# EAGLE design FED3_v6.3 (EAGLE 9.5.1)
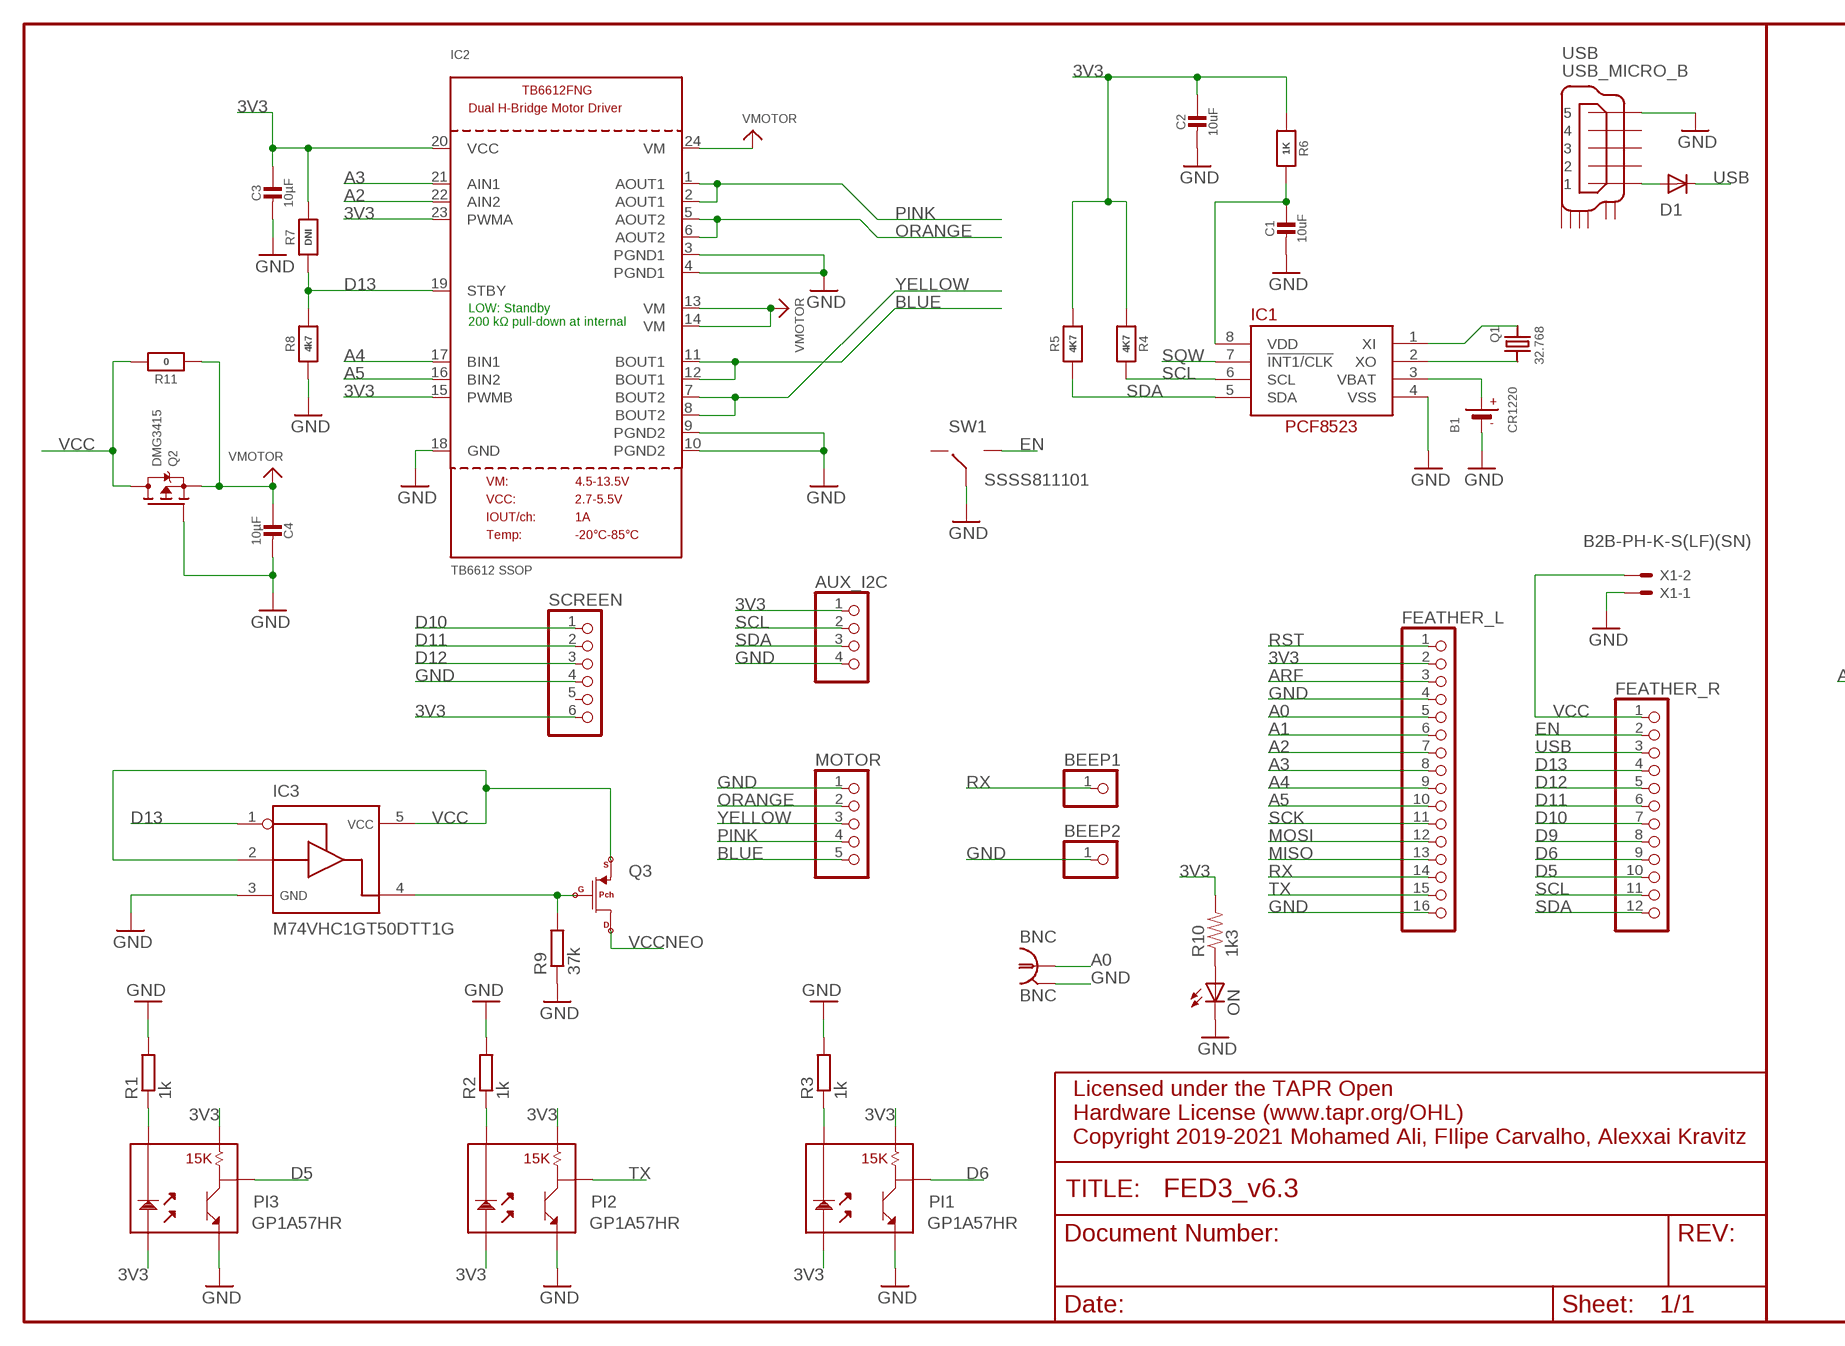
[diagram p0: schematic, sheet 1, part 1 of 2]
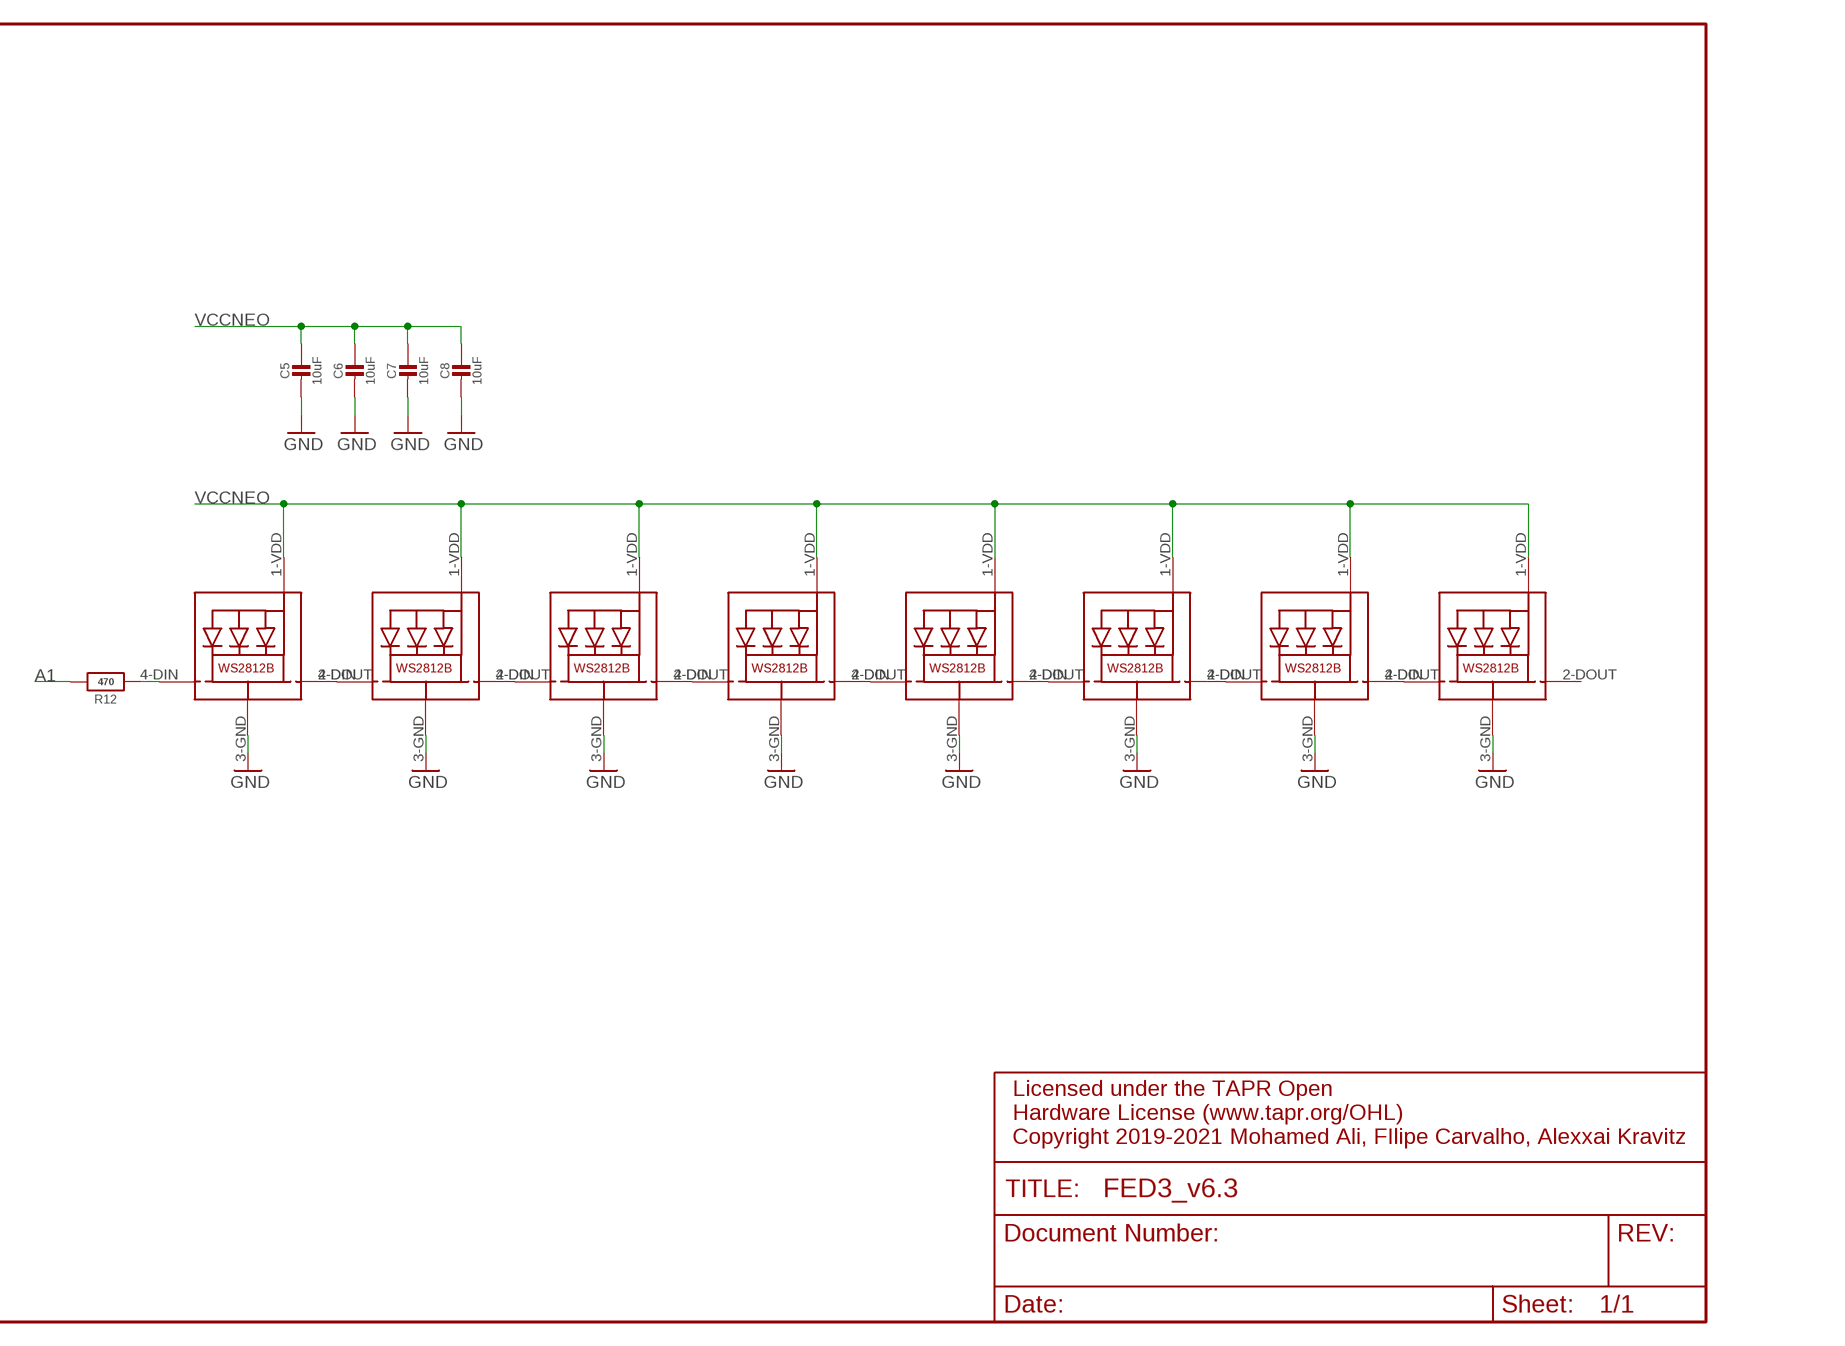
[diagram p1: schematic, sheet 1, part 2 of 2]

## Parts
AUX_I2C  PINHD-1X4  [1X04]
B1  CR1220  BATTERYCR1220_SMT  [CR1220]
BEEP1  PINHD-1X1  [1X01]
BEEP2  PINHD-1X1  [1X01]
BNC  BNC  [BNC_RA]
C1  10uF  CAP_CERAMIC0805-NOOUTLINE  [0805-NO]
C2  10uF  CAP_CERAMIC0805-NOOUTLINE  [0805-NO]
C3  10µF  CAP_CERAMIC0805-NOOUTLINE  [0805-NO]
C4  10µF  CAP_CERAMIC0805-NOOUTLINE  [0805-NO]
C5  10uF  CAP_CERAMIC0805-NOOUTLINE  [0805-NO]
C6  10uF  CAP_CERAMIC0805-NOOUTLINE  [0805-NO]
C7  10uF  CAP_CERAMIC0805-NOOUTLINE  [0805-NO]
C8  10uF  CAP_CERAMIC0805-NOOUTLINE  [0805-NO]
D1  DIODE-DO-214AC  [DO-214AC]
FEATHER_L  PINHD-1X16  [1X16]
FEATHER_R  PINHD-1X12  [1X12]
IC1  RTC_PCF8523T  [SOIC8_150MIL]
IC2  TB6612 SSOP  TB6612FNGSSOP  [SSOP24]
IC3  M74VHC1GT50DTT1G  SN74LVC1G125  [SOT23-5]
LED1  WS2812B5050  [WS2812B]
LED2  WS2812B5050  [WS2812B]
LED3  WS2812B5050  [WS2812B]
LED4  WS2812B5050  [WS2812B]
LED5  WS2812B5050  [WS2812B]
LED6  WS2812B5050  [WS2812B]
LED7  WS2812B5050  [WS2812B]
LED8  WS2812B5050  [WS2812B]
MOTOR  PINHD-1X5  [1X05]
ON  LEDCHIPLED_0603  [CHIPLED_0603]
PI1  GP1A57HR  [GP1A57HR]
PI2  GP1A57HR  [GP1A57HR]
PI3  GP1A57HR  [GP1A57HR]
Q1  32.768  CRYSTAL8.0X3.8  [CRYSTAL_8X3.8]
Q2  DMG3415  MOSFET-PWIDE  [SOT23-WIDE]
Q3  MOSFET_P-CH  [TSMT3]
R1  1k  R-EU_R0805  [R0805]
R2  1k  R-EU_R0805  [R0805]
R3  1k  R-EU_R0805  [R0805]
R4  4K7  RESISTOR0805_NOOUTLINE  [0805-NO]
R5  4K7  RESISTOR0805_NOOUTLINE  [0805-NO]
R6  1K  RESISTOR0805_NOOUTLINE  [0805-NO]
R7  DNI  RESISTOR0805_NOOUTLINE  [0805-NO]
R8  4k7  RESISTOR0805_NOOUTLINE  [0805-NO]
R9  37k  R-EU_R0805  [R0805]
R10  1k3  RESISTOR  [0805]
R11  0  RESISTOR0805_NOOUTLINE  [0805-NO]
R12  470  RESISTOR0805_NOOUTLINE  [0805-NO]
SCREEN  PINHD-1X6  [1X06]
SW1  SSSS811101  [SSSS811101]
USB  USB_MICRO_B  [ZX62D-B-5P8]
X1  B2B-PH-K-S(LF)(SN)  JST-XH-02-PIN-ROUND-PAD  [JST-XH-02-PACKAGE-ROUND-PAD]

## Nets
3V3: AUX_I2C.1 C2.1 C3.1 FEATHER_L.2 IC2.15(PWMB) IC2.20(VCC) IC2.23(PWMA) PI1.1 PI1.3 PI2.1 PI2.3 PI3.1 PI3.3 R4.1 R5.2 R6.1 R7.2 R10.2 SCREEN.6
A0: BNC.1 FEATHER_L.5
A1: FEATHER_L.6 R12.2
A2: FEATHER_L.7 IC2.22(AIN2)
A3: FEATHER_L.8 IC2.21(AIN1)
A4: FEATHER_L.9 IC2.17(BIN1)
A5: FEATHER_L.10 IC2.16(BIN2)
ARF: FEATHER_L.3
BLUE: IC2.11(BOUT1) IC2.12(BOUT1) MOTOR.5
D5: FEATHER_R.10 PI3.4
D6: FEATHER_R.9 PI1.4
D9: FEATHER_R.8
D10: FEATHER_R.7 SCREEN.1
D11: FEATHER_R.6 SCREEN.2
D12: FEATHER_R.5 SCREEN.3
D13: FEATHER_R.4 IC2.19(STBY) IC3.1 R7.1 R8.2
EN: FEATHER_R.2 SW1.3
GND: AUX_I2C.4 B1.- BEEP2.1 BNC.2 C1.2 C2.2 C3.2 C4.2 C5.2 C6.2 C7.2 C8.2 FEATHER_L.4 FEATHER_L.16 IC1.4(VSS) IC2.3(PGND1) IC2.4(PGND1) IC2.9(PGND2) IC2.10(PGND2) IC2.18(GND) IC3.3 LED1.3-GND(GND) LED2.3-GND(GND) LED3.3-GND(GND) LED4.3-GND(GND) LED5.3-GND(GND) LED6.3-GND(GND) LED7.3-GND(GND) LED8.3-GND(GND) MOTOR.1 ON.C PI1.5 PI2.5 PI3.5 Q2.1(G) R1.2 R2.2 R3.2 R8.1 R9.1 SCREEN.4 SW1.2 USB.P$5 X1.1
MISO: FEATHER_L.13
MOSI: FEATHER_L.12
N$1: PI2.2 R2.1
N$2: PI3.2 R1.1
N$3: PI1.2 R3.1
N$4: D1.A USB.P$1
N$5: LED1.2-DOUT(DO) LED2.4-DIN(DI)
N$6: C1.1 IC1.8(VDD) R6.2
N$7: LED2.2-DOUT(DO) LED3.4-DIN(DI)
N$8: ON.A R10.1
N$9: LED3.2-DOUT(DO) LED4.4-DIN(DI)
N$10: LED4.2-DOUT(DO) LED5.4-DIN(DI)
N$11: LED5.2-DOUT(DO) LED6.4-DIN(DI)
N$12: LED6.2-DOUT(DO) LED7.4-DIN(DI)
N$13: LED7.2-DOUT(DO) LED8.4-DIN(DI)
N$14: IC1.1(XI) Q1.P$1
N$15: IC1.2(XO) Q1.P$4
N$16: LED1.4-DIN(DI) R12.1
ORANGE: IC2.5(AOUT2) IC2.6(AOUT2) MOTOR.2
OUT3: IC3.4 Q3.P$1(G) R9.2
PINK: IC2.1(AOUT1) IC2.2(AOUT1) MOTOR.4
RST: FEATHER_L.1
RX: BEEP1.1 FEATHER_L.14
SCK: FEATHER_L.11
SCL: AUX_I2C.2 FEATHER_R.11 IC1.6(SCL) R4.2
SDA: AUX_I2C.3 FEATHER_R.12 IC1.5(SDA) R5.1
SQW: IC1.7(!INT1/CLK)
TX: FEATHER_L.15 PI2.4
USB: D1.C FEATHER_R.3
VBAT1: B1.+$1(+) IC1.3(VBAT)
VCC: FEATHER_R.1 IC3.2 IC3.5 Q2.3(D) Q3.P$2(S) R11.2 X1.2
VCCNEO: C5.1 C6.1 C7.1 C8.1 LED1.1-VDD(VDD) LED2.1-VDD(VDD) LED3.1-VDD(VDD) LED4.1-VDD(VDD) LED5.1-VDD(VDD) LED6.1-VDD(VDD) LED7.1-VDD(VDD) LED8.1-VDD(VDD) Q3.P$3(D)
VMOTOR: C4.1 IC2.13(VM) IC2.14(VM) IC2.24(VM) Q2.2(S) R11.1
YELLOW: IC2.7(BOUT2) IC2.8(BOUT2) MOTOR.3
Unconnected: LED8.2-DOUT(DO) SCREEN.5 SW1.1 USB.P$2 USB.P$3 USB.P$4 USB.P$6 USB.P$7 USB.SHIELD_1 USB.SHIELD_2 USB.SHIELD_3 USB.SHIELD_4

## Notes on the sheet
- LOW: Standby
  200 kΩ pull-down at internal
- Licensed under the TAPR Open
  Hardware License (www.tapr.org/OHL)
  Copyright 2019-2021 Mohamed Ali, FIlipe Carvalho, Alexxai Kravitz
- Licensed under the TAPR Open
  Hardware License (www.tapr.org/OHL)
  Copyright 2019-2021 Mohamed Ali, FIlipe Carvalho, Alexxai Kravitz

## Library data of the parts
AUX_I2C = pinhead:PINHD-1X4: PIN HEADER
B1 = microbuilder:BATTERY: CR1220 SMT - Digikey: 3001K-ND CD2032 BAT-HLD-001 - Digikey: BAT-HLD-001-ND
BEEP1 BEEP2 = pinhead:PINHD-1X1: PIN HEADER
BNC = CNP-connectors:BNC
C1-C8 = microbuilder:CAP_CERAMIC: Ceramic Capacitors For new designs, use the packages preceded by an '_' character since they are more reliable: The following footprints should be used on most boards: _0402 - Standard footprint for regular board layouts _0603 - Standard footprint for regular board layouts _0805 - Standard footprint for regular board layouts _1206 - Standard footprint for regular board layouts For extremely tight-pitch boards where space is at a premium, the following 'micro-pitch' footprints can be used (smaller pads, no silkscreen outline, etc.): _0402MP - Micro-pitch footprint for very dense/compact boards _0603MP - Micro-pitch footprint for very dense/compact boards _0805MP - Micro-pitch footprint for very dense/compact boards _1206MP - Micro-pitch footprint for very dense/compact boards
D1 = diode:DIODE-: DIODE
FEATHER_L = pinhead:PINHD-1X16: PIN HEADER
FEATHER_R = pinhead:PINHD-1X12: PIN HEADER
IC1 = microbuilder:RTC_PCF8523
IC2 = microbuilder:TB6612FNG: TB6612FNG Dual H-Bridge Motor Driver
IC3 = My_library 0v2:SN74LVC1G125
LED1-LED8 = microbuilder:WS2812B5050
MOTOR = pinhead:PINHD-1X5: PIN HEADER
ON = led:LED: LED OSRAM: - CHIPLED LG R971, LG N971, LY N971, LG Q971, LY Q971, LO R971, LY R971 LH N974, LH R974 LS Q976, LO Q976, LY Q976 LO Q996 - Hyper CHIPLED LW Q18S LB Q993, LB Q99A, LB R99A - SideLED LS A670, LO A670, LY A670, LG A670, LP A670 LB A673, LV A673, LT A673, LW A673 LH A674 LY A675 LS A676, LA A676, LO A676, LY A676, LW A676 LS A679, LY A679, LG A679 - Hyper Micro SIDELED® LS Y876, LA Y876, LO Y876, LY Y876 LT Y87S - SmartLED LW L88C, LW L88S LB L89C, LB L89S, LG L890 LS L89K, LO L89K, LY L89K LS L896, LA L896, LO L896, LY L896 - TOPLED LS T670, LO T670, LY T670, LG T670, LP T670 LSG T670, LSP T670, LSY T670, LOP T670, LYG T670 LG T671, LOG T671, LSG T671 LB T673, LV T673, LT T673, LW T673 LH T674 LS T676, LA T676, LO T676, LY T676, LB T676, LH T676, LSB T676, LW T676 LB T67C, LV T67C, LT T67C, LS T67K, LO T67K, LY T67K, LW E67C LS E67B, LA E67B, LO E67B, LY E67B, LB E67C, LV E67C, LT E67C LW T67C LS T679, LY T679, LG T679 LS T770, LO T770, LY T770, LG T770, LP T770 LB T773, LV T773, LT T773, LW T773 LH T774 LS E675, LA E675, LY E675, LS T675 LS T776, LA T776, LO T776, LY T776, LB T776 LHGB T686 LT T68C, LB T68C - Hyper Mini TOPLED® LB M676 - Mini TOPLED Santana® LG M470 LS M47K, LO M47K, LY M47K Source: http://www.osram.convergy.de LUXEON: - LUMILED® LXK2-PW12-R00, LXK2-PW12-S00, LXK2-PW14-U00, LXK2-PW14-V00 LXK2-PM12-R00, LXK2-PM12-S00, LXK2-PM14-U00 LXK2-PE12-Q00, LXK2-PE12-R00, LXK2-PE12-S00, LXK2-PE14-T00, LXK2-PE14-U00 LXK2-PB12-K00, LXK2-PB12-L00, LXK2-PB12-M00, LXK2-PB14-N00, LXK2-PB14-P00, LXK2-PB14-Q00 LXK2-PR12-L00, LXK2-PR12-M00, LXK2-PR14-Q00, LXK2-PR14-R00 LXK2-PD12-Q00, LXK2-PD12-R00, LXK2-PD12-S00 LXK2-PH12-R00, LXK2-PH12-S00 LXK2-PL12-P00, LXK2-PL12-Q00, LXK2-PL12-R00 Source: www.luxeon.com KINGBRIGHT: KA-3528ASYC Source: www.kingbright.com
PI1-PI3 = SparkFun:GP1A57HR
Q1 = microbuilder:CRYSTAL: Crystals HC49UP - Surface Mount Crystal 4.0MHz 18pF +/-30ppm Surface Mount Crystal [Digikey: 535-9857-1-ND] 12.0 MHz Surface Mount Crystal [Digikey: 535-9869-6-ND] 25.0 MHz Surface Mount Crystal [Digikey: 535-9078-1-ND] 2.5 x 2.0mm - MEMs SMT Crystal 16.0 MHz 10pF 20ppm 2.5 x 2.0mm Crystal [Digikey -40-85°C: 535-10923-1-ND] 3.2 x 2.5mm - MEMs SMT Crystal 12.0 MHz 8pF 15ppm 3.2 x 2.5mm Crystal [Digikey: -10-70°C: 644-1047-1-ND -40-125°C: 644-1128-1-ND] 40~85°C cheaper: 644-1173-6-ND 16.0 MHz 8pF 15ppm 3.2 x 2.5mm Crystal [Digikey: -10-70°C: 644-1049-1-ND -40-125°C: 644-1129-2-ND]-40~85°C cheaper: 644-1175-6-ND 16.0 MHz 10pF 10ppm 3.2 x 2.5mm Crystal [Digikey: 644-1100-1-ND] 27.12 MHz 18pF 30ppm 3.2 x 2.5mm Crystal [Digikey: 887-1424-1-ND] 27.12MHz 10pF 10ppm 3.2 x 2.5mm Crystal [Digikey: 887-1329-1-ND] 4.9 x 1.8mm - MEMs SMT Crystal 32.768 KHz 12.5pF 20ppm 4.9 x 1.8mm Crystal [Digikey: SE2415CT-ND] 8.0 x 3.8mm - Surface Mount Crystal 32.768kHz 12.5pF 20ppm -40°C-85°C [Digikey: 535-9166-2-ND] Cylinder 32.768KHz Cylinder Crystal (2x6mm body) [Ex. Digikey: 300-8341-2-ND]
Q2 = microbuilder:MOSFET-P: P-Channel Mosfet LEGEND VDS: Voltage Drain-Source ID: Drain Current RDS(ON): Drain-Source On-State Resistance VGS(TH): Gate-Source Threshold Voltage CISS: Drain-Source Input Capacitance SOT-23 Name VDS ID RDS(ON) VGS(TH) CISS Order Number IRLML5103 30V 760mA 600 mOhm -- 75pF @ 25V Digikey: IRLML5103PBFCT-ND IRLML6401 12V 4.3A 50 mOhm 950mV @ 250µA 830pF @ 10V Digikey: IRLML6401PBFTR-ND NTR0202PL 20V 400mA 800 mOhm 2.3V @ 250uA 70pF @ 5V Digikey: NTR0202PLT1GOSTR-ND NTR4101PT1G 20V 1.8A 85 mOhm 1.2V @ 250uA 675pF @ 10V Digikey: NTR4101PT1GOSCT-ND DMP2004K 20V 600mA 900 mOhm 1V @ 250uA 175pF @ 16V Digikey: DMP2004KDICT-ND PMV65XP 20V 3.9A 76 mOhm 950mV @ 1mA 725pF @ 20V Digikey: 568-2358-2-ND TO-252 Name VDS ID RDS(ON) VGS(TH) CISS Order Number AOD417 30V 25A 34 mOhm 3V @ 250µA 920pF @ 15V Digikey: 785-1106-2-ND
Q3 = CNP-miscellaneous:MOSFET_P-CH
R1-R3 R9 = rcl:R-EU_: RESISTOR, European symbol
R4-R8 R11 R12 = microbuilder:RESISTOR: Resistors For new designs, use the packages preceded by an '_' character since they are more reliable: The following footprints should be used on most boards: _0402 - Standard footprint for regular board layouts _0603 - Standard footprint for regular board layouts _0805 - Standard footprint for regular board layouts _1206 - Standard footprint for regular board layouts For extremely tight-pitch boards where space is at a premium, the following 'micro-pitch' footprints can be used (smaller pads, no silkscreen outline, etc.): _0402MP - Micro-pitch footprint for very dense/compact boards _0603MP - Micro-pitch footprint for very dense/compact boards _0805MP - Micro-pitch footprint for very dense/compact boards _1206MP - Micro-pitch footprint for very dense/compact boards
R10 = SparkFun:RESISTOR: Resistor Basic schematic elements and footprints for 0603, 1206, and PTH 1/10th watt (small) resistors.
SCREEN = pinhead:PINHD-1X6: PIN HEADER
SW1 = SSSS811101:SSSS811101
USB = CNP-connectors:USB_MICRO_B
X1 = Rembrandt Electronics - JST XH Connectors v1-0:JST-XH-02-PIN: JST XH Connector 2 Pin Wire to board connector. Pitch: 2,54 mm, (0.100") Number of pins: 2 Created by Rembrandt Electronics www.rembrandtelectronics.com

## Board
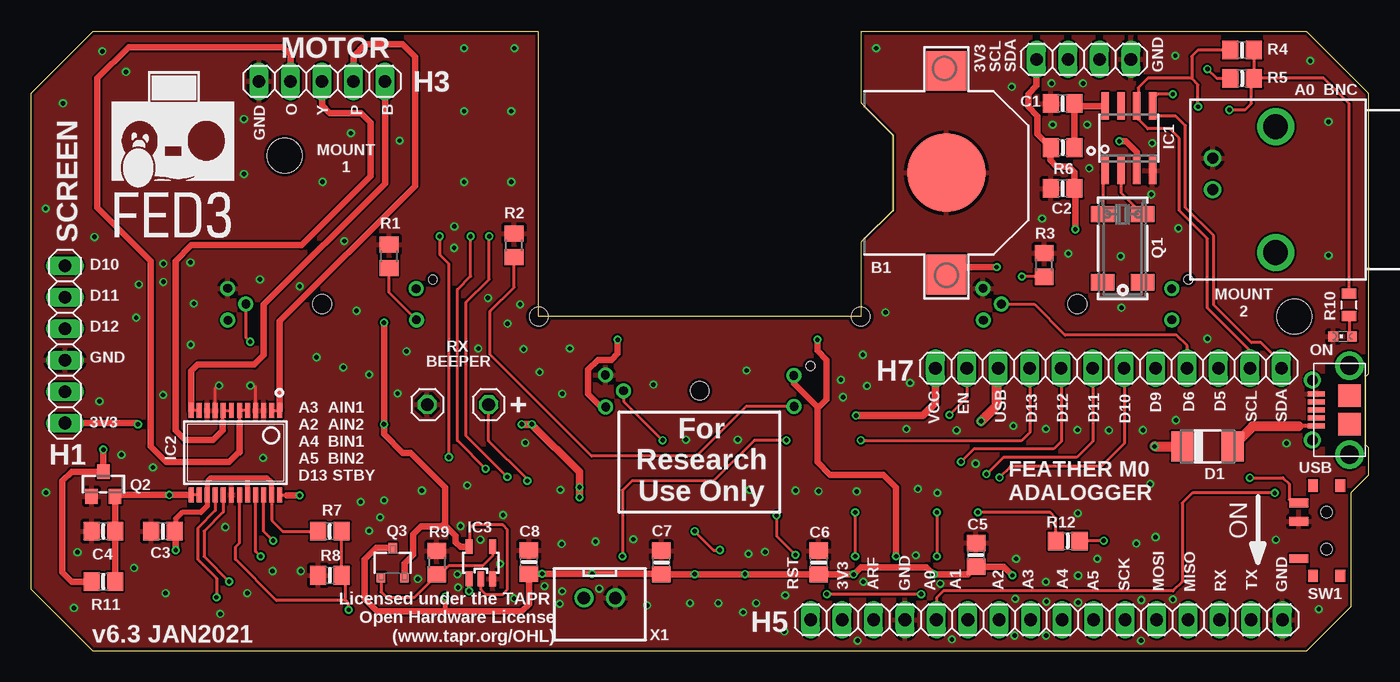
[diagram p2: board, top side]
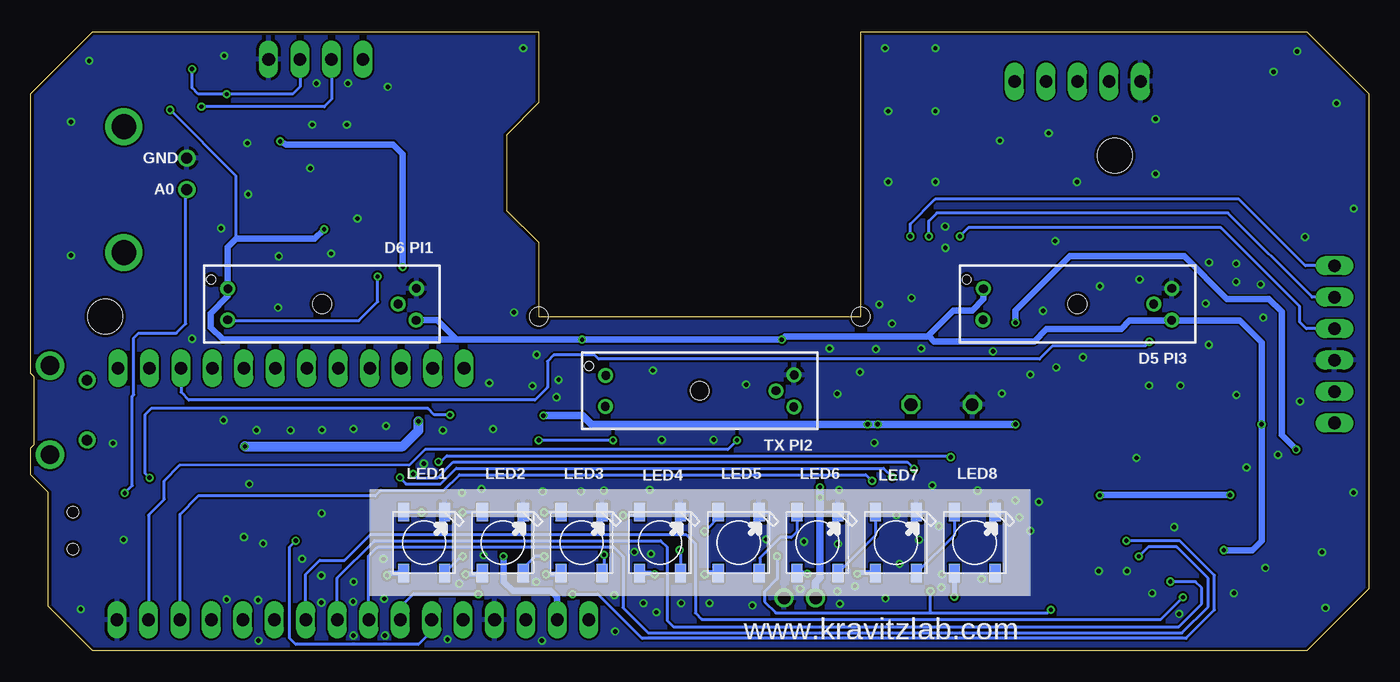
[diagram p3: board, bottom side, seen from below]

Size 108 x 50 mm. Coordinates in mm from the lower left corner, seen from the top.
Outline: 0,45 0,5 5,0 103,0 106.6,3.6 106.6,12.8 108,14.2 108,16.4 107.72,16.68 107.72,22.12 108,22.4 108,45 103,50 67,50 67,44.25 69.6,41.66 69.6,35.56 67,33.02 67,27 41,27 41,50 5,50 0,45
Copper layers (1*16): Top 0.035mm / dielectric 1.5mm / Bottom 0.035mm
Design rules "seeed-studio-2-layer *": minimum track width 6mil, minimum drill 12mil, track to track 6mil, track to pad 6mil, pad to pad 6mil, via to via 6mil, smd to smd 0mil, copper to edge 10mil, drill to drill 10mil, minimum pad ring 10mil, minimum via ring 6mil, stop-mask expansion 2mil, vias tented up to drill 100mil, thermal gap 10mil
Holes 2.8 mm at 20.5,40 102,27
Holes 1.5 mm at 41,27 67,27

### Footprints (pad centres in the part's own frame; a part is rotated, then mirrored left to right if it is on the bottom)
1X04 = drill 1.016 long: 1 -3.81,0; 2 -1.27,0; 3 1.27,0; 4 3.81,0
CR1220 = smd 3.2 x 3.2: +$1 -8.225,0; +$2 8.225,0 | smd 6.35 x 6.35: - 0,0
1X01 = drill 1.016 octagon: 1 0,0
BNC_RA = drill 0.9 pad 1.27: 1 0,-5.08; 2 -2.54,-5.08 | drill 2: P$1 -5.08,0; P$2 5.08,0
0805-NO = smd 1.3 x 1.5: 1 -0.95,0; 2 0.95,0
DO-214AC = smd 1.8 x 2.4: A 2.025,0; C -2.025,0
1X16 = drill 1.016 long: 1 -19.05,0; 2 -16.51,0; 3 -13.97,0; 4 -11.43,0; 5 -8.89,0; 6 -6.35,0; 7 -3.81,0; 8 -1.27,0; 9 1.27,0; 10 3.81,0; 11 6.35,0; 12 8.89,0; 13 11.43,0; 14 13.97,0; 15 16.51,0; 16 19.05,0
1X12 = drill 1.016 long: 1 -13.97,0; 2 -11.43,0; 3 -8.89,0; 4 -6.35,0; 5 -3.81,0; 6 -1.27,0; 7 1.27,0; 8 3.81,0; 9 6.35,0; 10 8.89,0; 11 11.43,0; 12 13.97,0
SOIC8_150MIL = smd 0.6 x 2.2: 1 -1.905,-2.6; 2 -0.635,-2.6; 3 0.635,-2.6; 4 1.905,-2.6; 5 1.905,2.6; 6 0.635,2.6; 7 -0.635,2.6; 8 -1.905,2.6
SSOP24 = smd 0.4 x 1.2: 1 -3.575,-3.42; 2 -2.925,-3.42; 3 -2.275,-3.42; 4 -1.625,-3.42; 5 -0.975,-3.42; 6 -0.325,-3.42; 7 0.325,-3.42; 8 0.975,-3.42; 9 1.625,-3.42; 10 2.275,-3.42; 11 2.925,-3.42; 12 3.575,-3.42; 13 3.575,3.42; 14 2.925,3.42; 15 2.275,3.42; 16 1.625,3.42; 17 0.975,3.42; 18 0.325,3.42; 19 -0.325,3.42; 20 -0.975,3.42; 21 -1.625,3.42; 22 -2.275,3.42; 23 -2.925,3.42; 24 -3.575,3.42
SOT23-5 = smd 0.55 x 1.2: 1 -0.95,-1.3; 2 0,-1.3; 3 0.95,-1.3; 4 0.95,1.3; 5 -0.95,1.3
WS2812B = smd 1.5 x 0.9: 1-VDD 2.45,-1.65; 2-DOUT 2.45,1.65; 3-GND -2.45,1.65; 4-DIN -2.45,-1.65
1X05 = drill 1.016 long: 1 -5.08,0; 2 -2.54,0; 3 0,0; 4 2.54,0; 5 5.08,0
CHIPLED_0603 = smd 0.8 x 0.8: A 0,-0.75; C 0,0.75
GP1A57HR = drill 0.7: 1 -7.6,1.24; 2 -7.62,-1.27; 3 7.6,-1.3; 4 6.15,0; 5 7.62,1.27 | hole 1.5: 0,0 | hole 0.7: -8.95,2
CRYSTAL_8X3.8 = smd 1.3 x 1.9: P$1 -2.75,-1.6; P$2 2.75,-1.6; P$3 2.75,1.6; P$4 -2.75,1.6
SOT23-WIDE = smd 1 x 1.2: 1 -0.95,-1; 2 0.95,-1; 3 0,1
TSMT3 = smd 0.7 x 0.8: P$1 -0.95,-1.2; P$2 0.95,-1.2; P$3 0,1.2
R0805 = smd 1.3 x 1.5: 1 -0.95,0; 2 0.95,0
0805 = smd 0.8 x 1.2: 1 -0.9,0; 2 0.9,0
1X06 = drill 1.016 long: 1 -6.35,0; 2 -3.81,0; 3 -1.27,0; 4 1.27,0; 5 3.81,0; 6 6.35,0
SSSS811101 = smd 0.7 x 1.5: 1 -2.25,2.25; 2 0.75,2.25; 3 2.25,2.25 | smd 1 x 0.8: SHIELD@1 -3.65,1.1; SHIELD@2 -3.65,-1.1; SHIELD@3 3.65,-1.1; SHIELD@4 3.65,1.1 | hole 0.9: -1.5,0; 1.5,0
ZX62D-B-5P8 = smd 0.4 x 1.35: P$1 -1.3,2.675; P$2 -0.65,2.675; P$3 0,2.675; P$4 0.65,2.675; P$5 1.3,2.675 | smd 1.8 x 1.8: P$6 -1.15,0; P$7 1.15,0 | drill 1.5 pad 2.3: SHIELD_1 -3.6,0; SHIELD_2 3.6,0 | drill 0.85 pad 1.25: SHIELD_3 2.425,3; SHIELD_4 -2.425,3
JST-XH-02-PACKAGE-ROUND-PAD = drill 1.016: 1 -1.27,0; 2 1.27,0

### Placement (x,y rotation side)
AUX_I2C  85,47.78 0 top
B1  73.91,38.61 90 top
BEEP1  36.95,19.88 0 top
BEEP2  32,19.88 0 top
BNC  100.5,37.25 270 top
C1  83.31,44.2 180 top
C2  83.31,37.34 180 top
C3  10.67,9.65 180 top
C4  5.84,9.65 180 top
C5  76.3,7.75 90 top
C6  63.6,7.14 90 top
C7  50.9,7.14 90 top
C8  40.21,7.16 90 top
D1  95,16.51 0 top
FEATHER_L  82,2.5 0 top
FEATHER_R  87,22.82 0 top
IC1  88.65,41.4 0 top
IC2  16.51,16 180 top
IC3  36.32,7.11 0 top
LED1  76.25,8.74 270 bottom
LED2  69.9,8.74 270 bottom
LED3  63.55,8.74 270 bottom
LED4  57.2,8.74 270 bottom
LED5  50.85,8.74 270 bottom
LED6  44.5,8.74 270 bottom
LED7  38.15,8.74 270 bottom
LED8  31.8,8.74 270 bottom
MOTOR  23.5,46 0 top
ON  105.92,25.4 90 top
PI1  84.5,28 0 bottom
PI2  54,21 0 bottom
PI3  23.5,28 0 bottom
Q1  88.14,32.51 270 top
Q2  5.84,13.46 0 top
Q3  29.21,7.11 0 top
R1  28.92,31.87 90 top
R2  39.01,32.75 90 top
R3  81.81,31.16 90 top
R4  97.79,48.51 180 top
R5  97.79,46.23 0 top
R6  83.31,40.64 0 top
R7  24.13,9.65 180 top
R8  24.13,6.1 0 top
R9  32.77,7.11 270 top
R10  106.43,27.94 90 top
R11  5.84,5.59 180 top
R12  83.72,8.86 0 top
SCREEN  2.75,24.75 270 top
SW1  104.62,9.7 90 top
USB  106.46,19.44 90 top
X1  45.92,4.27 180 top

### Tracks (layer width: path | path; a pad name or v marks a point on that pad's centre or on a via)
3V3  (via drill 0.35)
  Top 0.254: 63.5,19.5 63.5,19.57 63.5,19.68 | PI2.3 46.04,19.7 | PI2.1 61.6,21.58 | R4.1 98.74,46.74 | 98.74,46.74 R5.2 98.55,46.04 98.55,44.2 98.04,43.69 v96.77,43.69 | IC2.23 19.43,10.54 20.32,9.65 R7.2 | R10.2 106.43,44.2 104.39,46.23 99.25,46.23 98.74,46.74
  Top 0.406: IC2.23 19.43,13.59 19.05,13.97 17.48,13.97 | 17.48,13.97 14.53,13.97 14.23,13.68 IC2.15 14.23,11.7 13.72,11.18 12.19,11.18 11.68,10.67 11.68,9.72 C3.1 | IC2.20 17.48,13.97
  Top 0.508: v47.37,25.13 47.37,24 46.87,23.5 45.78,23.5 45,22.72 45,20.74 46.04,19.7 | 63.5,19.5 63.5,15.24 64.52,14.22 68.83,14.22 69.85,13.21 v69.85,7.62 | v63.5,25.13 63.5,24.25 64.25,23.5 64.25,20.32 63.5,19.57 | 61.6,21.58 63.5,19.68 | v84.33,34.04 84.33,37.27 C2.1 84.26,38.67 83.82,39.12 82.8,39.12 82.3,39.62 82.3,40.57 R6.1 81.28,41.72 81.28,43.18 80.52,43.94 80.52,44.96 81.19,45.63 AUX_I2C.1 | 11.68,9.72 v11.68,8.13 | SCREEN.6 8.52,18.4 v8.64,18.29
  Bottom 0.254: 35.62,25.38 35.59,25.38 | 75.3,26.7 75.2,26.7 | 91.44,33.27 91.44,38.35 v96.77,43.69
  Bottom 0.406: 16,26.67 15.93,26.67
  Bottom 0.508: PI3.1 31.1,28.4 32,27.5 33.5,27.5 35.62,25.38 47.12,25.38 v47.37,25.13 v63.5,25.13 73.63,25.13 | PI1.3 75.3,26.7 | 75.2,26.7 73.63,25.13 | 73.63,25.13 92.5,25.13 93.5,26.13 93.5,27.25 92.1,28.65 PI1.1 92.1,32.61 91.44,33.27 85.09,33.27 v84.33,34.04 | v11.68,8.13 9.4,8.13 8.64,8.89 v8.64,18.29 8.64,24.89 10.41,26.67 16,26.67 | PI3.3 15.93,26.67 19.3,26.67 19.97,26 26,26 27,25 35.08,25 35.46,25.38 35.59,25.38 | v69.85,7.62 69.85,5.59 69.09,4.83 66.04,4.83 65.53,4.32 65.53,2.54 FEATHER_L.2
A0  (via drill 0.35)
  Top 0.254: v100.44,12.74 93.76,12.74 92.96,11.94 92.96,5.59 92.2,4.83 73.66,4.83 73.11,4.28 FEATHER_L.5
  Bottom 0.254: BNC.1 95.5,37.17 95.5,26.42 96.27,25.65 99.31,25.65 99.69,25.27 99.69,20.7 99.82,20.57 99.82,13.35 v100.44,12.74
A1  (via drill 0.35)
  Top 0.254: v86.61,8.89 84.69,8.89 R12.2
  Bottom 0.254: FEATHER_L.6 75.65,1.57 76.71,0.51 86.61,0.51 87.12,1.02 87.12,8.38 v86.61,8.89
A2  (via drill 0.35)
  Top 0.254: v19.56,8.89 18.79,9.66 IC2.22 | v71.88,4.57 v64.26,4.57
  Bottom 0.254: FEATHER_L.7 78.26,2.57 78.26,3.68 78.03,3.68 77.1,4.62 71.93,4.62 v71.88,4.57 | v19.56,8.89 15.24,8.89 12.45,6.1 12.45,3.3 14.75,1 58.64,1 62.22,4.57 v64.26,4.57
A3  (via drill 0.35)
  Top 0.254: v18.54,7.62 18.14,8.03 IC2.21
  Bottom 0.254: v18.54,7.62 17.78,8.38 15.49,8.38 12.95,5.84 12.95,3.56 15.06,1.45 58.17,1.45 60.2,3.48 60.2,7.62 60.96,8.38 80.01,8.38 80.73,7.66 FEATHER_L.8
A4  (via drill 0.35)
  Top 0.254: IC2.17 15.54,11.22 13.97,9.65 13.97,7.62 v16,5.59
  Bottom 0.254: v16,5.59 13.97,5.59 13.46,5.08 13.46,3.81 15.32,1.95 56.13,1.95 56.64,2.46 56.64,8.38 57.15,8.89 80.26,8.89 83.27,5.88 FEATHER_L.9
A5  (via drill 0.35)
  Top 0.254: IC2.16 14.88,11.33 13.46,9.91 13.46,7.37 14.99,5.84 v14.99,4.32
  Bottom 0.254: FEATHER_L.10 85.81,6.19 84.68,7.32 82.67,7.32 80.59,9.4 55.12,9.4 54.36,8.64 54.36,3.06 53.85,2.55 16.75,2.55 v14.99,4.32
BLUE
  Top 0.254: IC2.11 IC2.12
  Top 0.508: MOTOR.5 28.58,37.74 18.8,27.96 18.8,23.88 18.03,23.11 13.46,23.11 12.94,22.59 IC2.12
D5  (via drill 0.35)
  Top 0.254: PI3.4 17.35,25.31 v17.7,24.96
  Bottom 0.254: FEATHER_R.10 95.89,20.89 95.25,20.25 67.31,20.25 66.29,21.27 66.29,23.37 65.79,23.88 62.48,23.88 62.17,23.56 26.57,23.56 25.49,24.64 18.02,24.64 v17.7,24.96
D6
  Top 0.254: PI1.4 81,28 83.5,25.5 92.5,25.5 93.35,24.65 FEATHER_R.9
D10  (via drill 0.35)
  Top 0.254: v78.21,13.99 79.12,14.9 86.44,14.9 88.27,16.73 FEATHER_R.7 | v37,33.48 37,30 35.15,28.15 35.15,17.35 v38.46,14.04
  Bottom 0.254: v37,33.48 37,34.48 35.01,36.47 10.47,36.47 5.1,31.1 SCREEN.1 | v78.21,13.99 78.21,13.95 77.72,13.46 74.93,13.46 73.66,14.73 39.15,14.73 v38.46,14.04
D11  (via drill 0.35)
  Top 0.254: v77.14,14.27 77.17,14.27 78.53,15.63 84.44,15.63 85.73,16.91 FEATHER_R.6 | v36.7,14.7 34.43,16.98 34.43,29.19 35.5,30.26 v35.5,33.48
  Bottom 0.254: v35.5,33.48 35.5,34.73 34.87,35.36 11.36,35.36 4.56,28.56 SCREEN.2 | v36.7,14.7 37.24,15.24 73.91,15.24 75.18,13.97 76.84,13.97 v77.14,14.27
D12  (via drill 0.35)
  Top 0.254: FEATHER_R.5 83.19,16.9 82.59,16.3 76.14,16.3 v75.1,15.26 | v33,33.48 33,32 33.74,31.26 v33.74,15.64
  Bottom 0.254: SCREEN.3 5.02,26.02 5.57,26.57 5.57,27.81 11.93,34.17 32.3,34.17 v33,33.48 | v75.1,15.26 74.91,15.26 74.42,15.75 33.85,15.75 v33.74,15.64
D13  (via drill 0.35)
  Top 0.254: FEATHER_R.4 80.65,17.63 79.97,16.95 67.2,16.95 v67,17 | IC2.19 16.84,8.71 16.51,8.38 16.51,7.37 19.81,4.06 25.4,4.06 | R7.1 R8.2 25.4,6.03 25.4,4.06 | v61,17 58.4,17 55.12,13.72 48.51,13.72 47.75,12.95 v47.75,7.62 | v25.65,3.3 25.65,3.81 25.4,4.06 | v35.37,4.83 35.37,4.7 IC3.1
  Bottom 0.254: v61,17 v67,17 | 35.37,3.05 47.85,3.05 48.77,3.96 48.77,4.78 47.75,5.79 v47.75,7.62 | 35.37,3.05 25.91,3.05 v25.65,3.3 | 35.37,3.05 v35.37,4.83
EN  (via drill 0.35)
  Top 0.254: FEATHER_R.2 75.57,20.45 v74.17,19.05 | v98.42,13.97 101.09,13.97 101.6,13.46 101.6,12.19 101.85,11.94 102.36,11.94 SW1.3
  Bottom 0.254: v74.17,19.05 75.44,19.05 75.95,19.56 98.3,19.56 98.81,19.05 98.81,14.35 v98.42,13.97
GND  (via drill 0.35)
  Top 0.254: IC2.9 14.88,21.21 v15.18,21.42 | IC2.4 18.14,21.32 v17.72,21.42
  other vias: 1.19,35.71 81.94,5.57 85.29,42.5 82.49,42.5 84.94,45.83 82.4,45.83 90.53,41.01 87.99,31.86 81.64,34.91 85.45,38.97 21.79,6.43 18.74,15.58 15.69,9.99 10.66,20.66 7.31,15.83 8.32,6.69 17.47,4.65 26.61,12.02 12.9,24.72 9.85,14.81 3.75,7.96 10.86,4.65 92.65,34.12 83.76,32.09 79.19,45.55 90.47,36.86 23.06,23.7 5.76,48.41 39.04,48.67 3.48,3.46 68.25,48.67 103.3,47.65 69.01,27.33 41.07,22.51 29.77,41.2 76.28,15.11 65.41,21.88 57.78,22.64 42.75,12.99 39.9,16.8 58.04,12.99 42.85,8.62 90.81,9.18 89.79,17.82 60.83,1.56 100.53,8.97 103.98,3.36 101.38,16.76 5.53,20.15 1.21,12.78 19.5,6.43 28.52,12.15 35.23,13.36 70.99,21.63 39.5,27.98 34.16,32.55 17.19,38.51 25.83,41.81 70.69,17.91 79.32,18.16 67.18,23.91 55.5,3.85 58.55,3.85 38.78,37.87 38.78,43.59 34.97,48.67 2.59,44.22 34.97,43.59 34.97,37.87 23.54,37.87 17.19,42.95 7.67,46.76 5.13,33.43 10.69,29.8 10.69,31.27 8.71,29.59 12.87,31.37 18.49,30 21.69,29.44 25.29,33.1 26.29,27.46 8.5,26.9 13.15,28.05 15.28,2.98 53.21,3.84 49.75,3.66 45.89,5.01 45.59,8.82 48.63,9 57.93,7.83 59.28,7.98 57.5,3.1 60.9,4.48 61.74,12.93 63.6,12.88 66.67,12.86 71.62,13.06 73.2,12.76 89.25,8.67 84.52,11.11 79.47,4.2 79.55,7.42 81.98,3.97 84.55,6.08 84.55,3.89 86.1,7.42 89.66,4.1 92.2,4.15 89.63,0.82 81.96,1.23 79.42,1.23 74.36,0.92 66.74,0.82 71.44,7.7 28.19,10.78 27.3,9.68 31.57,12.93 25.22,22.89 43.5,24.42 36.11,24.42 39.77,24.36 30.32,24.19 29.61,20.78 27.3,22.31 36.9,28.5 34.18,34.27 42.89,20.76 38.47,26.42 50.26,21.49 65.58,20.48 67.51,21.39 41.47,5.21 90.37,13.47 74.75,17.81 81.96,17.91 84.5,17.84 87.04,17.81 92.45,18.62 94.99,25.2 88.06,27.72 104.77,31.93 104.77,42.73 92.4,48.06 34.44,6.18 36.29,8.97 39.01,4.22 34.49,5.11 31.24,5.8 67.2,5.57 73.42,5.42 57.07,17.05 52.88,17.05 38.12,10.95 34.69,10.06 37.87,7.02 42.89,4.81 42.69,3.79
  pour Bottom: 0,5 5,0 103,0 108,5 108,45 103,50 67,50 67,27 41,27 41,50 5,50 0,45
  pour Top: 0,5 5,0 102.87,0 107.97,5.1 107.97,45.03 103,50 67,50 67,27 41,27 41,50 5,50 0,45
N$1
  Top 0.254: PI2.2 57.73,19.73 53.72,15.72 45.28,15.72 37.08,23.92 37.08,27.43 39.01,29.36 R2.1
N$2
  Top 0.254: PI3.2 28.92,28.93 R1.1
N$3  (via drill 0.35)
  Top 0.254: v80.01,30.23 80.04,30.26 81.81,30.26 R3.1
  Bottom 0.254: PI1.2 92.06,26.67 81.53,26.67 80.01,28.19 v80.01,30.23
N$4
  Top 0.305: USB.P$1 102.37,18.14 102.36,18.14
  Top 0.813: 102.36,18.14 98.65,18.14 D1.A
N$5  (via drill 0.35)
  Top 0.254: v73.15,11.18 v73.15,7.62
  Bottom 0.254: LED2.4-DIN v73.14,11.19 v73.15,11.18 | v73.15,7.62 73.27,7.62 LED1.2-DOUT
N$6
  Top 0.508: IC1.8 84.46,44 C1.1 R6.2
N$7  (via drill 0.35)
  Top 0.254: v66.55,11.18 v66.55,7.62
  Bottom 0.254: LED3.4-DIN 66.54,11.19 v66.55,11.18 | v66.55,7.62 67.31,7.62 68.07,6.86 68.33,6.36 LED2.2-DOUT
N$8
  Top 0.254: R10.1 106.43,25.64 ON.A
N$9  (via drill 0.35)
  Top 0.254: v60.2,10.92 60.2,9.27 v61.72,7.75
  Bottom 0.254: LED4.4-DIN 59.12,10.92 v60.2,10.92 | v61.72,7.75 61.72,6.47 LED3.2-DOUT
N$10  (via drill 0.35)
  Top 0.254: v53.59,9.65 55.12,8.13 v55.63,8.13
  Bottom 0.254: 52.32,10.92 v53.59,9.65 | v55.63,8.13 55.55,8.05 LED4.2-DOUT
  Bottom 0.406: LED5.4-DIN 52.32,11.01 52.32,10.92
N$11
  Bottom 0.254: LED6.4-DIN 46.15,9.6 46.61,9.14 47.5,9.14 49.15,7.49 49.15,6.34 LED5.2-DOUT
N$12
  Bottom 0.254: LED7.4-DIN 39.8,9.34 LED6.2-DOUT
N$13
  Bottom 0.254: LED8.4-DIN 33.45,9.34 LED7.2-DOUT
N$14
  Top 0.254: IC1.1 arc90 86.54,38.6 Q1.P$1
N$15
  Top 0.254: IC1.2 88.01,36.99 Q1.P$4
N$16  (via drill 0.35)
  Top 0.254: R12.1 82.77,10.7 82.3,11.18 v76.45,11.18
  Bottom 0.254: v76.45,11.18 77.91,11.18 LED1.4-DIN
ORANGE
  Top 0.254: 16.87,18.49 arc-90 16.84,18.52 IC2.6 IC2.5
  Top 0.508: 16.87,18.49 16.87,16.1 arc-90 16.76,16 16,15.24 10.92,15.24 9.65,16.51 9.65,31.5 5.33,35.81 5.33,46.23 7.87,48.77 20.32,48.77 20.96,48.13 MOTOR.2
OUT3
  Top 0.254: Q3.P$1 28.26,4.76 28.7,4.32 30.99,4.32 32.38,5.71 R9.2 33.02,6.16 33.72,6.86 36.45,6.86 37.27,7.68 IC3.4
PINK
  Top 0.254: IC2.2 IC2.1
  Top 0.508: MOTOR.4 26.04,48.04 27,49 30,49 31,48 31,37.54 20.09,26.62 IC2.1
RX  (via drill 0.35)
  Top 0.254: BEEP1.1 36.95,16.96 40.08,13.83 v40.08,13.72
  Bottom 0.254: FEATHER_L.14 95.97,11.03 94.5,12.5 80.21,12.5 79.76,12.95 74.68,12.95 73.41,14.22 40.59,14.22 v40.08,13.72
SCL  (via drill 0.35)
  Top 0.254: v94.23,43.94 94.23,45.72 93.73,46.23 | 93.73,46.23 90.17,46.23 89.41,45.47 89.41,44.13 IC1.6 89.41,43.88 89.41,42.93 90.17,42.16 91.95,42.16 92.71,41.4 92.71,35.56 95,33.27 95,27.69 98.43,24.25 FEATHER_R.11 | R4.2 94.23,48.51 93.73,48.01 93.73,46.23
  Bottom 0.254: AUX_I2C.2 83.73,44.54 84.33,43.94 v94.23,43.94
SDA  (via drill 0.35)
  Top 0.254: v92.2,44.96 90.93,44.96 90.68,44.7 90.68,44.13 IC1.5 90.68,43.88 90.68,43.18 92.46,43.18 93.22,42.42 93.22,35.81 95.5,33.53 95.5,27.94 98.55,24.89 99.31,24.89 100.97,23.24 FEATHER_R.12 | v95,46.99 95.76,46.23 R5.1
  Bottom 0.254: AUX_I2C.3 86.27,45.56 86.87,44.96 v92.2,44.96 94.49,44.96 95,45.47 v95,46.99
TX  (via drill 0.35)
  Top 0.254: PI2.4 47.85,20.15 v51,17
  Bottom 0.254: FEATHER_L.15 98.51,10.96 97.24,12.23 97.24,13.73 95.98,14.99 77.47,14.99 76.19,16.26 51.74,16.26 v51,17
USB  (via drill 0.35)
  Top 0.813: v76.71,18.54 77.98,19.81 77.98,22.69 FEATHER_R.3 | v90.73,16.51 D1.C
  Bottom 0.813: v90.73,16.51 77.98,16.51 76.71,17.78 v76.71,18.54
VBAT1  (via drill 0.35)
  Top 0.508: B1.+$1 74.07,30.38 74.93,30.99 v77.98,30.99 | v87.88,41.15 88.39,41.15 89.28,40.26 IC1.3
  Bottom 0.508: v77.98,30.99 77.98,40.13 78.74,40.89 87.38,40.89 v87.88,41.15
VCC  (via drill 0.35)
  Top 0.254: IC3.2 36.32,4.95 36.7,4.57 38.1,4.57 38.48,4.95 38.48,9.78 38.1,10.16 35.69,10.16 35.43,9.91 35.43,8.47 IC3.5
  Top 0.508: v28.5,26.5 v28.5,18.29 28.5,17.5 30,16 30.64,16 33.45,13.2 33.45,10.11 33.53,10.03 | v5.84,16.26 Q2.3 3.29,14.46 2.54,13.72 2.54,6.35 3.3,5.59 R11.2 | 33.45,10.34 33.15,10.03 | Q3.P$2 30.16,7.05 30.86,7.75 30.86,9.4 31.5,10.03 33.15,10.03 | 33.53,10.03 34.29,9.27 34.29,8.76 34.67,8.38 35.34,8.38 IC3.5 | 33.15,10.03 33.53,10.03
  Top 0.61: FEATHER_R.1 73.03,20.03 72,19 v66.63,19 | v44.3,12.39 v44.3,13.21 44.3,14.43 v40.44,18.29 v39.62,18.29
  Bottom 0.508: v28.5,26.5 28.5,27.5 24.11,31.89 14.89,31.89 11.43,28.43 8.05,28.43 7.01,27.39 7.01,17.42 v5.84,16.26
  Bottom 0.61: v66.63,19 63.45,19 62.74,18.29 v40.44,18.29 v39.62,18.29 v28.5,18.29 | X1.2 44.65,5.54 44.3,5.89 v44.3,13.21
VCCNEO  (via drill 0.35)
  Top 0.406: v33.45,4.37 33.45,3.35 33.4,3.17
  Top 0.508: Q3.P$3 27.87,8.31 26.92,7.37 26.92,4.19 27.94,3.17 33.4,3.17 39.62,3.17 40.21,3.76 C8.1 v41.27,6.21 v45.31,6.21 50.88,6.21 C7.1 v53.59,6.19 v57.66,6.19 C6.1 63.63,6.16 v66.42,6.16 66.44,6.16 67.03,6.76 72.3,6.76 v72.9,6.16 75.67,6.16 C5.1 78.55,6.8 v79.25,6.1
  Bottom 0.406: LED8.1-VDD 33.45,4.52 33.48,4.37 v33.45,4.37 | LED7.1-VDD 41.33,6.29 v41.27,6.21 | LED6.1-VDD 45.39,6.29 v45.31,6.21 | LED5.1-VDD 53.49,6.29 v53.59,6.19 | LED4.1-VDD 58.01,6.29 v57.66,6.19 | LED3.1-VDD 65.33,6.16 v66.42,6.16 | LED2.1-VDD 71.68,6.16 v72.9,6.16 | v79.25,6.1 79.06,6.29 LED1.1-VDD
VMOTOR  (via drill 0.35)
  Top 0.254: IC2.14 IC2.13 | 20.62,12.55 20.12,12.55 IC2.24
  Top 0.508: IC2.13 v11.18,12.58 6.91,12.58 Q2.2 C4.1 R11.1 | v21.69,12.55 20.62,12.55
  Bottom 0.508: v21.69,12.55 21.69,12.58 v11.18,12.58
YELLOW
  Top 0.254: 15.49,18.54 15.49,19.38 IC2.8 IC2.7
  Top 0.508: 15.49,18.54 15.49,17.78 14.73,17.02 12.45,17.02 11.68,17.78 11.68,31.5 12.95,32.77 21.84,32.77 27.43,38.35 27.43,42.67 26.67,43.43 24.13,43.43 23.5,44.06 MOTOR.3

### Text on the board
tPlace: A0 | RX | + | A3 AIN1 / A2 AIN2 / A4 BIN1 / A5 BIN2 / D13 STBY | For / Research / Use Only | ON | Licensed under the TAPR / Open Hardware License / (www.tapr.org/OHL) | v6.3 JAN2021
tNames: 3V3 | SCL | SDA | GND | H3 | GND | O | Y | P | B | MOUNT / 1 | D10 | D11 | MOUNT / 2 | D12 | GND | BEEPER | H7 | EN | D9 | D6 | D5 | 3V3 | VCC | USB | D13 | D12 | D11 | D10 | SCL | SDA | H1 | FEATHER M0 / ADALOGGER | RST | 3V3 | ARF | GND | A0 | A1 | A2 | A3 | A4 | A5 | SCK | MOSI | MISO | RX | TX | GND | H5
bNames: GND | A0 | D6 PI1 | D5 PI3 | TX PI2 | www.kravitzlab.com
tDocu: Licensed under the TAPR Open / Hardware License (www.tapr.org/OHL) / Copyright 2019 Mohamed Ali, FIlipe Carvalho, Alexxai Kravitz